# Altium schematic sheet [1] Power.SchDoc: Power
size A4; ApprovedBy: Muhammet YILDIZ; CheckedBy: Muhammet YILDIZ; Author: Muhammet YILDIZ; CompanyName: YıLDıZ IoT; DrawnBy: Muhammet YILDIZ; Engineer: Muhammet YILDIZ; Organization: YıLDıZ IoT; Address1: Elperek Mahallesi; Address2: Saray Sokak No:12; Address3: SAKARYA / TURKEY; Revision: 1; SheetNumber: 1; SheetTotal: 7; SheetSize: A4
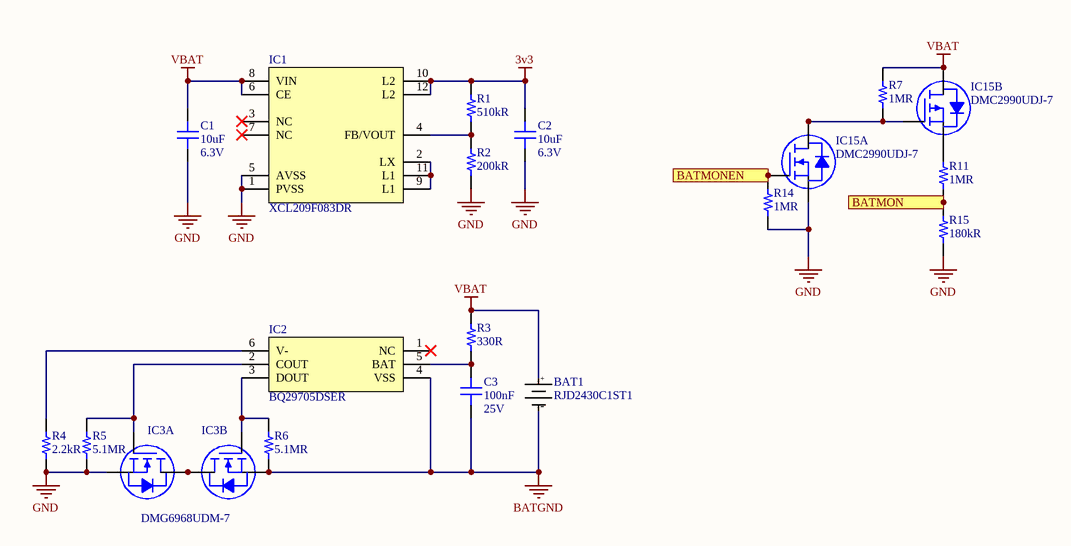
[diagram p0: [1] Power.SchDoc]

## Parts
BAT1  RJD2430C1ST1  [ILLINOIS RJD2430C1ST1]
C1  10uF  Voltage Rating: 6.3V  [CAP 0402/1005]
C2  10uF  Voltage Rating: 6.3V  [CAP 0402/1005]
C3  100nF  Voltage Rating (DC): 25V  [CAP 0402/1005]
IC1  XCL209F083DR  [TOREX XCL209F083DR]
IC2  BQ29705DSER  [TI S-PDSO-N6 150x150x80]
IC3  DMG6968UDM-7  [DIODES SOT-26-6]  (parts A,B of 2)
IC15  DMC2990UDJ-7  [DIODE SOT-563]  (parts A,B of 2)
R1  510kR  [RES 0402/1005]
R2  200kR  [RES 0402/1005]
R3  330R  [RES 0402/1005 RF]
R4  2.2kR  [RES 0402/1005 RF]
R5  5.1MR  [RES 0402/1005]
R6  5.1MR  [RES 0402/1005]
R7  1MR  [RES 0402/1005 RF]
R11  1MR  [RES 0402/1005 RF]
R14  1MR  [RES 0402/1005 RF]
R15  180kR  [RES 0402/1005 RF]

## Ports
BATMON (out), BATMONEN (in)

## Nets
3v3: C2.2 IC1.10(L2) IC1.12(L2) R1.2
BATGND: BAT1.2(-) C3.1 IC2.4(VSS) IC3.3(S2) R6.1
GND: C1.1 C2.1 IC1.1(PVSS) IC1.5(AVSS) IC3.1(S1) IC15.1(S1) R2.1 R4.1 R5.1 R14.1 R15.1
VBAT: BAT1.1(+) C1.2 IC1.6(CE) IC1.8(VIN) IC15.5(D2) IC15.6(D2) R3.2 R7.2
BATMON: R11.1 R15.2 ; port BATMON
BATMONEN: IC15.6(G1) R14.2 ; port BATMONEN
NetC3_2: C3.2 IC2.5(BAT) R3.1
NetIC1_2: IC1.2(LX) IC1.9(L1) IC1.11(L1)
NetIC1_4: IC1.4(FB/VOUT) R1.1 R2.2
NetIC2_2: IC2.2(COUT) IC3.6(G1) R5.2
NetIC2_3: IC2.3(DOUT) IC3.4(G2) R6.2
NetIC2_6: IC2.6(V-) R4.2
NetIC3_2: IC3.2(D1) IC3.5(D1)
NetIC15_2: IC15.2(D1) IC15.4(G2) IC15.5(D1) R7.1
NetIC15_3: IC15.3(S2) R11.2

Not connected (* = marked no-connect by the designer): IC1 3(NC)* 7(NC)*; IC2 1(NC)*

## Notes on the sheet
- Title:
- Size:
- Project:
- Revision:
- Sheet
- of
- Date:
- YıLDıZ IoT
- Elperek Mahallesi
- Saray Sokak, No:12
- SAKARYA / TURKEY
- File:

## Library data of the parts
BAT1 = ILLINOIS RJD2430C1ST1: Rechargeable Ion Lithium Coin-Cell Battery, Standard Lead Option. Capacity - Nom - 110mAh, Min - 104mAh; Manufacturer: Cornell Dubilier; Supplier 1: Digi-Key; Supplier Part Number 1: 1572-1630-ND; Manufacturer Part Number: RJD2430C1ST1; RoHS: No
C1 C2 = Capacitor - Ceramic: 0402 10 uF 6.3 V ±20 % Tolerance X5R Surface Mount Multilayer Ceramic Capacitor; Manufacturer: Murata; Manufacturer Part Number: GRM155R60J106ME15D; Tolerance: 20%; Supplier 1: Digi-Key; Supplier Part Number 1: 490-13238-1-ND; RoHS: Yes; Category: Ceramic Capacitors; Pricing 1: 1=0,18000, 10=0,12400, 50=0,07440, 100=0,06280, 500=0,04296, 1000=0,03800, 2500=0,03635, 5000=0,03304 (USD); Mount: Surface Mount; Case/Package: 0402; Case Code (Metric): 1005; Case Code (Imperial): 0402; Min Operating Temperature: -55°C; Max Operating Temperature: 85°C; Packaging: Tape and Reel; Capacitance: 10uF; Voltage Rating (DC): 6.3V; Dielectric: X5R; Length: 0.039inch; Width: 0.02inch; Thickness: 0.026inch; RoHS Compliant: Yes; ComponentLink1URL: https://www.murata.com/~/media/webrenewal/support/library/catalog/products/capacitor/mlcc/c02e.ashx?la=en-us&src-supplier=Digi-Key; ComponentLink1Description: https://www.murata.com/~/media/webrenewal/support/library/catalog/products/capacitor/mlcc/c02e.ashx?la=en-us&src-supplier=Digi-Key
C3 = Capacitor - Ceramic: Cap Ceramic 0.1uF 25V X5R 10% Pad SMD 0402 85¡ãC T/R / Multi Layer Ceramic Capacitor (MLCC); Manufacturer: Samsung; Manufacturer Part Number: CL05A104KA5NNNC; Supplier 1: Digi-Key; Supplier Part Number 1: 1276-1043-6-ND; RoHS: Yes; Category: Ceramic Capacitors; Pricing 1: 1=0,10000, 10=0,01100, 50=0,00600, 100=0,00490, 500=0,00346, 1000=0,00272, 2500=0,00248, 5000=0,00228 (USD); Mount: Surface Mount; Case/Package: 0402; Case Code (Imperial): 0402; Case Code (Metric): 1005; Min Operating Temperature: -55°C; Max Operating Temperature: 85°C; Capacitance: 100nF; Packaging: Tape and Reel; Tolerance: 10%; Package Quantity: 1; Voltage Rating: 25V; Dielectric: X5R; Voltage: 25V; Length: 1mm; Width: 0.02inch; Height: 0.5mm; Thickness: 0.022inch; Depth: 0.5mm; Radiation Hardening: No; Lead Free: Lead Free; ComponentLink1URL: https://datasheet.ciiva.com/25802/cl05a104ka5nnnc-25802704.pdf?src-supplier=Digi-Key; ComponentLink1Description: https://datasheet.ciiva.com/25802/cl05a104ka5nnnc-25802704.pdf?src-supplier=Digi-Key; ComponentLink2URL: https://datasheet.ciiva.com/16437/cl05a104ka5nnnc-16437369.pdf?src-supplier=Future+Electronics; ComponentLink2Description: https://datasheet.ciiva.com/16437/cl05a104ka5nnnc-16437369.pdf?src-supplier=Future+Electronics; ComponentLink3URL: https://datasheet.ciiva.com/26838/getdatasheetpartid-357412-26838142.pdf?src-supplier=Verical; ComponentLink3Description: https://datasheet.ciiva.com/26838/getdatasheetpartid-357412-26838142.pdf?src-supplier=Verical; ComponentLink4URL: https://datasheet.ciiva.com/26309/mlcc-catalogdownload2013-eng-26309014.pdf?src-supplier=Distrelec; ComponentLink4Description: https://datasheet.ciiva.com/26309/mlcc-catalogdownload2013-eng-26309014.pdf?src-supplier=Distrelec
IC1 = TOREX XCL209F083DR: Conv DC-DC 1.8V to 6V Step Down Single-Out 0.9V to 6V 0.4A 8-Pin USP-10B03; Manufacturer: Torex; Switching Frequency: 3.45MHz; Number of Outputs: 1; Output Voltage: 800mV; Output Current: 400mA; Efficiency: 90%; Output Type: Adjustable; Supplier 1: Digi-Key; Supplier Part Number 1: 893-1172-1-ND; Manufacturer Part Number: XCL209F083DR; RoHS: Yes; Category: Board Mount Modules; Stock 1: 9897; Pricing 1: 1=1,45000, 5=1,42800, 10=1,40800, 25=1,36640, 50=1,32520, 100=1,28370, 250=1,24232, 500=1,15948 (USD); Mount: Surface Mount; Case/Package: 2520; Number of Pins: 10; Case Code (Metric): 5650; Case Code (Imperial): 2520; Min Operating Temperature: -40°C; Max Operating Temperature: 85°C; Package Quantity: 1; Packaging: Cut Tape; Min Input Voltage: 1.8V; Max Input Voltage: 6V; Voltage - Output 1: 6V; Max Output Current: 400mA; Nominal Output Voltage: 800mV; Features: UVLO,SCP; Series: XCL209; Length: 0.1inch; Width: 0.08inch; Height: 0.04inch; REACH SVHC: No SVHC; RoHS Compliant: Yes; ComponentLink1URL: https://datasheet.ciiva.com/6783/1644175-6783217.pdf?src-supplier=Newark; ComponentLink1Description: https://datasheet.ciiva.com/6783/1644175-6783217.pdf?src-supplier=Newark; ComponentLink2URL: https://datasheet.ciiva.com/7658/1644175-7658934.pdf?src-supplier=Element14; ComponentLink2Description: https://datasheet.ciiva.com/7658/1644175-7658934.pdf?src-supplier=Element14; ComponentLink3URL: https://datasheet.ciiva.com/14152/xcl208-209-eng-tds-14152429.pdf?src-supplier=Distrelec; ComponentLink3Description: https://datasheet.ciiva.com/14152/xcl208-209-eng-tds-14152429.pdf?src-supplier=Distrelec
IC2 = TI BQ29705: Li-Ion/Li Polymer Advanced Single-Cell Battery Protector IC Family 6-WSON -40 to 85; Manufacturer: Texas Instruments; Number of Cells: 1; Fault Protection: Over Current,Short Circuit,Over/Under Voltage; Operating Supply Voltage: 28V; Supplier 1: Digi-Key; Supplier Part Number 1: 296-39946-1-ND; Manufacturer Part Number: BQ29705DSER; RoHS: Yes; Category: Battery Management; Stock 1: 2298; Pricing 1: 1=0,59000, 10=0,52100, 25=0,48960, 100=0,39970, 250=0,37128, 500=0,31600, 1000=0,27650 (USD); Mount: Surface Mount; Case/Package: WFDFN; Number of Pins: 6; Contact Plating: Gold; Min Operating Temperature: -40°C; Max Operating Temperature: 85°C; Packaging: Tape and Reel; Lead Free: Lead Free; RoHS Compliant: Yes; ComponentLink1URL: http://www.ti.com/lit/gpn/bq2970?src-supplier=Mouser; ComponentLink1Description: http://www.ti.com/lit/gpn/bq2970?src-supplier=Mouser; ComponentLink2URL: http://www.ti.com/lit/pdf/sluuaz3?src-supplier=Digi-Key; ComponentLink2Description: http://www.ti.com/lit/pdf/sluuaz3?src-supplier=Digi-Key; ComponentLink3URL: http://www.ti.com/lit/ds/symlink/bq2971.pdf?src-supplier=Digi-Key; ComponentLink3Description: http://www.ti.com/lit/ds/symlink/bq2971.pdf?src-supplier=Digi-Key; ComponentLink4URL: http://www.ti.com/general/docs/lit/getliterature.tsp?genericPartNumber=BQ2970&&fileType=pdf&src-supplier=Avnet; ComponentLink4Description: http://www.ti.com/general/docs/lit/getliterature.tsp?genericPartNumber=BQ2970&&fileType=pdf&src-supplier=Avnet
IC3 = DIODES DMG6968: Transistor MOSFET Array Dual N-CH 20V 6.5A 6-Pin SOT-26 T/R; Manufacturer: Diodes; Rds On Max: 24mR; Input Capacitance: 143pF; Max Power Dissipation: 850mW; Number of Elements: 2; Rise Time: 78ns; Turn-Off Delay Time: 562ns; Turn-On Delay Time: 53ns; Fall Time: 234ns; Gate to Source Voltage (Vgs): 8V; FET Type: 2 N-Channel; Polarity: N-CHANNEL; Supplier 1: Digi-Key; Supplier Part Number 1: DMG6968UDMDICT-ND; Manufacturer Part Number: DMG6968UDM-7; RoHS: Yes; Category: MOSFETs; Stock 1: 7421; Pricing 1: 1=0,51000, 10=0,43300, 100=0,32340, 500=0,25410, 1000=0,19635 (USD); Mount: Surface Mount; Case/Package: SOT-26; Number of Pins: 6; Min Operating Temperature: -55°C; Max Operating Temperature: 150°C; Package Quantity: 3000; Packaging: Tape and Reel; Drain to Source Voltage (Vdss): 20V; Continuous Drain Current (ID): 6.5A; Drain to Source Breakdown Voltage: 20V; Drain to Source Resistance: 24mR; Power Dissipation: 850mW; Element Configuration: Dual; Number of Channels: 2; On-State Resistance: 24mR; Series: -; Drain-source On Resistance-Max: 24mR; Length: 3mm; Width: 1.6mm; Height: 1.1mm; Radiation Hardening: No; REACH SVHC: No SVHC; Lead Free: Lead Free; RoHS Compliant: Yes; ComponentLink1URL: https://datasheet.ciiva.com/929/ds31758-929568.pdf?src-supplier=Digi-Key; ComponentLink1Description: https://datasheet.ciiva.com/929/ds31758-929568.pdf?src-supplier=Digi-Key; ComponentLink2URL: https://datasheet.ciiva.com/11174/ds31758-11174898.pdf?src-supplier=Avnet; ComponentLink2Description: https://datasheet.ciiva.com/11174/ds31758-11174898.pdf?src-supplier=Avnet; ComponentLink3URL: https://datasheet.ciiva.com/4443/ds31758-90272-4443012.pdf?src-supplier=Mouser; ComponentLink3Description: https://datasheet.ciiva.com/4443/ds31758-90272-4443012.pdf?src-supplier=Mouser; ComponentLink4URL: https://datasheet.ciiva.com/929/ds31758-929569.pdf?src-supplier=Digi-Key; ComponentLink4Description: https://datasheet.ciiva.com/929/ds31758-929569.pdf?src-supplier=Digi-Key
IC15 = DIODES DMC2400: Trans MOSFET N/P-CH 20V 0.45A/0.31A Automotive 6-Pin SOT-963 T/R; Manufacturer: Diodes; Rds On Max: 990mR; Input Capacitance: 27.6pF; Rise Time: 5.7ns; Continuous Drain Current (ID): 310mA; Max Power Dissipation: 350mW; Number of Channels: 2; Drain to Source Resistance: 1.9R; Gate to Source Voltage (Vgs): 8V; Fall Time: 16.4ns; Turn-Off Delay Time: 31.1ns; Turn-On Delay Time: 5.8ns; FET Type: N and P-Channel; Polarity: N-CHANNEL,P-CHANNEL; Supplier 1: Digi-Key; Supplier Part Number 1: DMC2990UDJ-7DICT-ND; Manufacturer Part Number: DMC2990UDJ-7; RoHS: Yes; Category: MOSFETs; Stock 1: 297152; Pricing 1: 1=0.45000, 10=0.36700, 100=0.24960, 500=0.18718, 1000=0.14038, 2000=0.12869, 5000=0.12088 (USD); Mount: Surface Mount; Case/Package: SOT-963; Number of Pins: 6; Min Operating Temperature: -55°C; Max Operating Temperature: 150°C; Packaging: Tape and Reel; Package Quantity: 10000; Drain to Source Voltage (Vdss): 20V; Drain to Source Breakdown Voltage: 20V; Series: -; Length: 1.05mm; Width: 0.85mm; Height: 0.45mm; Radiation Hardening: No; Lead Free: Lead Free; REACH SVHC: No SVHC; RoHS Compliant: Yes; ComponentLink1URL: https://datasheet.ciiva.com/11174/dmc2990udj-11174946.pdf?src-supplier=Avnet; ComponentLink1Description: https://datasheet.ciiva.com/11174/dmc2990udj-11174946.pdf?src-supplier=Avnet; ComponentLink2URL: https://datasheet.ciiva.com/13045/dmc2990udj-73233-13045836.pdf?src-supplier=Mouser; ComponentLink2Description: https://datasheet.ciiva.com/13045/dmc2990udj-73233-13045836.pdf?src-supplier=Mouser; ComponentLink3URL: https://datasheet.ciiva.com/928/dmc2990udj-928614.pdf?src-supplier=Digi-Key; ComponentLink3Description: https://datasheet.ciiva.com/928/dmc2990udj-928614.pdf?src-supplier=Digi-Key; ComponentLink4URL: https://datasheet.ciiva.com/928/dmc2990udj-928615.pdf?src-supplier=Digi-Key; ComponentLink4Description: https://datasheet.ciiva.com/928/dmc2990udj-928615.pdf?src-supplier=Digi-Key; ComponentLink5URL: https://datasheet.ciiva.com/928/dmc2990udj-928616.pdf?src-supplier=Digi-Key; ComponentLink5Description: https://datasheet.ciiva.com/928/dmc2990udj-928616.pdf?src-supplier=Digi-Key; ComponentLink6URL: https://datasheet.ciiva.com/17323/dmc2990udj-17323996.pdf?src-supplier=Avnet+Europe; ComponentLink6Description: https://datasheet.ciiva.com/17323/dmc2990udj-17323996.pdf?src-supplier=Avnet+Europe
R1 = Resistor_Chip: Surface Mount Chip Resistor, Thick Film, RC Series, 510 kohm, 63 mW, 1%, 50 V, 0402 [1005 Metric]; Manufacturer: Yageo; Manufacturer Part Number: RC0402FR-07510KL; Voltage Rating (DC): 50V; Power Rating: 63mW; Temperature Coefficient: 100ppm/°C; Supplier 1: Digi-Key; Supplier Part Number 1: 311-510KLRCT-ND; RoHS: Yes; Category: Chip SMD Resistors; Stock 1: 569113; Pricing 1: 1=0,10000, 10=0,01600, 100=0,00660, 1000=0,00299, 2500=0,00259, 5000=0,00214 (USD); Case/Package: 0402; Case Code (Imperial): 0402; Case Code (Metric): 1005; Size Code: 0402; Min Operating Temperature: -55°C; Max Operating Temperature: 155°C; Tolerance: 1%; Resistance: 510kR; Packaging: Tape and Reel; Package Quantity: 1; Features: Moisture Resistant; Voltage Rating: 50V; Termination: SMD/SMT; Resistor Type: Thick Film; Number of Terminations: 2; Max Power Dissipation: 63mW; Series: RC; Construction: Rectangular; Resistance Tolerance: 1%; Technology: THICK FILM; Length: 1mm; Width: 0.5mm; Height: 0.016inch; Depth: 0.5mm; Lead Free: Lead Free; REACH SVHC: Unknown; Military Standard: Not; RoHS Compliant: Yes; ComponentLink1URL: https://datasheet.ciiva.com/11808/0900766b80c66297-11808810.pdf?src-supplier=RSComponents; ComponentLink1Description: https://datasheet.ciiva.com/11808/0900766b80c66297-11808810.pdf?src-supplier=RSComponents; ComponentLink2URL: https://datasheet.ciiva.com/2453/pyu-r-int-thick-7-2453463.pdf?src-supplier=Digi-Key; ComponentLink2Description: https://datasheet.ciiva.com/2453/pyu-r-int-thick-7-2453463.pdf?src-supplier=Digi-Key; ComponentLink3URL: https://datasheet.ciiva.com/2453/pyu-r-int-thick-7-2453464.pdf?src-supplier=Digi-Key; ComponentLink3Description: https://datasheet.ciiva.com/2453/pyu-r-int-thick-7-2453464.pdf?src-supplier=Digi-Key; ComponentLink4URL: https://datasheet.ciiva.com/2453/pyu-r-int-thick-7-2453465.pdf?src-supplier=Digi-Key; ComponentLink4Description: https://datasheet.ciiva.com/2453/pyu-r-int-thick-7-2453465.pdf?src-supplier=Digi-Key; ComponentLink5URL: https://datasheet.ciiva.com/17419/pyu-rc0402-51-rohs-l-6-r-17419596.pdf?src-supplier=Future+Electronics; ComponentLink5Description: https://datasheet.ciiva.com/17419/pyu-rc0402-51-rohs-l-6-r-17419596.pdf?src-supplier=Future+Electronics
R2 = Resistor_Chip: Res General Purpose Thick Film 0402 200K Ohm 1% 1/16W ±100ppm/°C Molded SMD Paper T/R; Manufacturer: Yageo; Manufacturer Part Number: RC0402FR-07200KL; Power Rating: 62.5mW; Voltage Rating: 50V; Max Power Dissipation: 63mW; Supplier 1: Digi-Key; Supplier Part Number 1: 311-200KLRCT-ND; RoHS: Yes; Category: Chip SMD Resistors; Stock 1: 4634442; Pricing 1: 1=0,10000, 10=0,01600, 100=0,00660, 1000=0,00299, 2500=0,00259, 5000=0,00214 (USD); Case/Package: 0402; Case Code (Metric): 1005; Case Code (Imperial): 0402; Min Operating Temperature: -55°C; Max Operating Temperature: 155°C; Resistance: 200kR; Tolerance: 1%; Package Quantity: 1; Packaging: Tape and Reel; Resistor Type: Thick Film; Number of Terminations: 2; Termination: SMD/SMT; Temperature Coefficient: 100ppm/°C; Voltage Rating (DC): 50V; Features: Moisture Resistant; Series: RC; Construction: Rectangular; Resistance Tolerance: 1%; Technology: THICK FILM; Working Voltage: 50V; Length: 1mm; Width: 0.02inch; Height: 0.016inch; Depth: 0.5mm; REACH SVHC: No SVHC; Military Standard: Not; Lead Free: Lead Free; RoHS Compliant: Yes; ComponentLink1URL: https://datasheet.ciiva.com/2453/pyu-r-int-thick-7-2453556.pdf?src-supplier=Digi-Key; ComponentLink1Description: https://datasheet.ciiva.com/2453/pyu-r-int-thick-7-2453556.pdf?src-supplier=Digi-Key; ComponentLink2URL: https://datasheet.ciiva.com/2453/pyu-r-int-thick-7-2453557.pdf?src-supplier=Digi-Key; ComponentLink2Description: https://datasheet.ciiva.com/2453/pyu-r-int-thick-7-2453557.pdf?src-supplier=Digi-Key; ComponentLink3URL: https://datasheet.ciiva.com/15189/getdatasheetpartid-323720-15189381.pdf?src-supplier=Verical; ComponentLink3Description: https://datasheet.ciiva.com/15189/getdatasheetpartid-323720-15189381.pdf?src-supplier=Verical; ComponentLink4URL: https://datasheet.ciiva.com/2453/pyu-r-int-thick-7-2453558.pdf?src-supplier=Digi-Key; ComponentLink4Description: https://datasheet.ciiva.com/2453/pyu-r-int-thick-7-2453558.pdf?src-supplier=Digi-Key; ComponentLink5URL: https://datasheet.ciiva.com/12667/pyu-rc0402-51-rohs-l-6-r-12667911.pdf?src-supplier=Mouser; ComponentLink5Description: https://datasheet.ciiva.com/12667/pyu-rc0402-51-rohs-l-6-r-12667911.pdf?src-supplier=Mouser; ComponentLink6URL: https://datasheet.ciiva.com/7849/1018594-7849896.pdf?src-supplier=Element14; ComponentLink6Description: https://datasheet.ciiva.com/7849/1018594-7849896.pdf?src-supplier=Element14; ComponentLink7URL: https://datasheet.ciiva.com/7849/1018594-7849897.pdf?src-supplier=Element14; ComponentLink7Description: https://datasheet.ciiva.com/7849/1018594-7849897.pdf?src-supplier=Element14; ComponentLink8URL: https://datasheet.ciiva.com/46394/1018594-46394953.pdf?src-supplier=Element14; ComponentLink8Description: https://datasheet.ciiva.com/46394/1018594-46394953.pdf?src-supplier=Element14; ComponentLink9URL: https://datasheet.ciiva.com/16740/pyu-rc0402-51-rohs-l-6-r-16740636.pdf?src-supplier=Future+Electronics; ComponentLink9Description: https://datasheet.ciiva.com/16740/pyu-rc0402-51-rohs-l-6-r-16740636.pdf?src-supplier=Future+Electronics
R3 = Resistor_Chip: Res Thick Film 0402 330 Ohm 1% 0.063W(1/16W) ±100ppm/C Pad SMD T/R; Manufacturer: Walsin Technologies; Manufacturer Part Number: WR04X3300FTL; Voltage Rating: 50V; Power Rating: 62.5mW; Temperature Coefficient: 100ppm/°C; Supplier 1: Digi-Key; Supplier Part Number 1: 1292-WR04X3300FTLCT-ND; RoHS: Yes; Category: Chip SMD Resistors; Stock 1: 4930; Pricing 1: 1=0,10000, 10=0,01000, 100=0,00360, 1000=0,00162, 2500=0,00140, 5000=0,00116 (USD); Case/Package: Molded; Case Code (Metric): 1005; Case Code (Imperial): 0402; Contact Material: Tin; Min Operating Temperature: -55°C; Max Operating Temperature: 155°C; Packaging: Tape and Reel; Resistance: 330R; Tolerance: 1%; Resistor Type: Thick Film,Metal Oxide; Voltage Rating (DC): 50V; Length: 1mm; Depth: 0.5mm; REACH SVHC: Unknown; Military Standard: Not; Lead Free: Lead Free; RoHS Compliant: Yes; ComponentLink1URL: http://www.farnell.com/datasheets/1960319.pdf?src-supplier=Farnell; ComponentLink1Description: http://www.farnell.com/datasheets/1960319.pdf?src-supplier=Farnell; ComponentLink2URL: https://www.verical.com/server-webapp/html/getDatasheet?partID=413958&src-supplier=Verical; ComponentLink2Description: https://www.verical.com/server-webapp/html/getDatasheet?partID=413958&src-supplier=Verical; ComponentLink3URL: http://components.arrow.com/part/dataview/0323_00666659?src-supplier=Arrow+Europe; ComponentLink3Description: http://components.arrow.com/part/dataview/0323_00666659?src-supplier=Arrow+Europe; ComponentLink4URL: http://www.farnell.com/datasheets/1960319.pdf?src-supplier=Element14; ComponentLink4Description: http://www.farnell.com/datasheets/1960319.pdf?src-supplier=Element14
R4 = Resistor_Chip: Res General Purpose Thick Film 0402 2.2k Ohm 1% 1/16W ±100ppm/°C Molded Paper T/R; Manufacturer: TE Connectivity; Manufacturer Part Number: CRGCQ0402F2K2; Max Power Dissipation: 63mW; Supplier 1: Digi-Key; Supplier Part Number 1: A129631CT-ND; RoHS: Yes; Category: Chip SMD Resistors; Stock 1: 176792; Pricing 1: 1=0,10000, 10=0,02600, 100=0,01040, 1000=0,00466, 2500=0,00405, 5000=0,00334 (USD); Case/Package: 0402; Case Code (Imperial): 0402; Case Code (Metric): 1005; Min Operating Temperature: -55°C; Max Operating Temperature: 155°C; Resistor Type: Thick Film; Features: Moisture Resistant,Automotive AEC-Q200; Packaging: Cut Tape; Resistance: 2.2kR; Tolerance: 1%; Temperature Coefficient: 100ppm/°C; Number of Terminations: 2; RoHS Compliant: Yes; ComponentLink1URL: http://www.te.com/commerce/DocumentDelivery/DDEController?Action=srchrtrv&DocNm=1773204-3&DocType=DS&DocLang=English&src-supplier=Digi-Key; ComponentLink1Description: http://www.te.com/commerce/DocumentDelivery/DDEController?Action=srchrtrv&DocNm=1773204-3&DocType=DS&DocLang=English&src-supplier=Digi-Key; ComponentLink2URL: https://4donline.ihs.com/images/VipMasterIC/IC/TYEL/TYEL-S-A0004929575/TYEL-S-A0004929575-1.pdf?hkey=52A5661711E402568146F3353EA87419&src-supplier=Newark; ComponentLink2Description: https://4donline.ihs.com/images/VipMasterIC/IC/TYEL/TYEL-S-A0004929575/TYEL-S-A0004929575-1.pdf?hkey=52A5661711E402568146F3353EA87419&src-supplier=Newark; ComponentLink3URL: https://www.te.com/commerce/DocumentDelivery/DDEController?Action=srchrtrv&DocNm=1773204-3&DocType=DS&DocLang=English&src-supplier=Digi-Key; ComponentLink3Description: https://www.te.com/commerce/DocumentDelivery/DDEController?Action=srchrtrv&DocNm=1773204-3&DocType=DS&DocLang=English&src-supplier=Digi-Key; ComponentLink4URL: https://4donline.ihs.com/images/VipMasterIC/IC/TYEL/TYEL-S-A0004929575/TYEL-S-A0004929575-1.pdf?hkey=52A5661711E402568146F3353EA87419&src-supplier=Farnell; ComponentLink4Description: https://4donline.ihs.com/images/VipMasterIC/IC/TYEL/TYEL-S-A0004929575/TYEL-S-A0004929575-1.pdf?hkey=52A5661711E402568146F3353EA87419&src-supplier=Farnell; ComponentLink5URL: https://www.te.com/commerce/DocumentDelivery/DDEController?Action=srchrtrv&amp;DocNm=1773204-3&amp;DocType=DS&amp;DocLang=English&src-supplier=Digi-Key; ComponentLink5Description: https://www.te.com/commerce/DocumentDelivery/DDEController?Action=srchrtrv&amp;DocNm=1773204-3&amp;DocType=DS&amp;DocLang=English&src-supplier=Digi-Key
R5 R6 = Resistor_Chip: Res Thick Film 0402 5.1M Ohm 1% 0.063W ±200ppm/°C Molded SMD Paper T/R; Manufacturer: Stackpole Electronics; Manufacturer Part Number: RMCF0402FT5M10; Max Power Dissipation: 63mW; Supplier 1: Digi-Key; Supplier Part Number 1: RMCF0402FT5M10CT-ND; RoHS: Yes; Category: Chip SMD Resistors; Stock 1: 115841; Pricing 1: 1=0,10000, 10=0,02000, 100=0,00810, 1000=0,00366, 2500=0,00318, 5000=0,00262 (USD); Mount: Surface Mount; Case/Package: 0402; Contact Plating: Tin,Matte; Min Operating Temperature: -55°C; Max Operating Temperature: 155°C; Packaging: Tape and Reel; Resistance: 5.1MR; Tolerance: 1%; Resistor Type: Thick Film; Number of Terminations: 2; Temperature Coefficient: 200ppm/°C; Features: Automotive AEC-Q200; Series: RMCF; Length: 0.039inch; Width: 0.02inch; Height: 0.016inch; Radiation Hardening: No; RoHS Compliant: Yes; ComponentLink1URL: https://www.seielect.com/Catalog/SEI-RMCF_RMCP.pdf?src-supplier=Digi-Key; ComponentLink1Description: https://www.seielect.com/Catalog/SEI-RMCF_RMCP.pdf?src-supplier=Digi-Key; ComponentLink2URL: https://www.seielect.com/catalog/SEI-RMCF_RMCP.pdf?src-supplier=Avnet; ComponentLink2Description: https://www.seielect.com/catalog/SEI-RMCF_RMCP.pdf?src-supplier=Avnet; ComponentLink3URL: https://www.seielect.com/catalog/SEI-Packaging.pdf?src-supplier=Digi-Key; ComponentLink3Description: https://www.seielect.com/catalog/SEI-Packaging.pdf?src-supplier=Digi-Key
R7 R11 R14 = Resistor_Chip: Res Thick Film 0402 1M Ohm 1% 0.063W(1/16W) ±100ppm/C Pad SMD Automotive T/R; Manufacturer: TE Connectivity; Manufacturer Part Number: CRGCQ0402F1M0; Max Power Dissipation: 63mW; Temperature Coefficient: 100ppm/°C; Supplier 1: Digi-Key; Supplier Part Number 1: A129663CT-ND; RoHS: Yes; Category: Chip SMD Resistors; Stock 1: 5520437; Pricing 1: 1=0.10000, 10=0.02600, 100=0.01040, 1000=0.00466, 2500=0.00405, 5000=0.00334 (USD); Case/Package: 0402; Case Code (Imperial): 0402; Case Code (Metric): 1005; Min Operating Temperature: -55°C; Max Operating Temperature: 155°C; Resistor Type: Thick Film; Features: Moisture Resistant,Automotive AEC-Q200; Packaging: Tape and Reel; Resistance: 1MR; Tolerance: 1%; Number of Terminations: 2; RoHS Compliant: Yes; ComponentLink1URL: https://4donline.ihs.com/images/VipMasterIC/IC/TYEL/TYEL-S-A0004929575/TYEL-S-A0004929575-1.pdf?hkey=52A5661711E402568146F3353EA87419&src-supplier=Farnell; ComponentLink1Description: https://4donline.ihs.com/images/VipMasterIC/IC/TYEL/TYEL-S-A0004929575/TYEL-S-A0004929575-1.pdf?hkey=52A5661711E402568146F3353EA87419&src-supplier=Farnell; ComponentLink2URL: https://4donline.ihs.com/images/VipMasterIC/IC/TYEL/TYEL-S-A0004929575/TYEL-S-A0004929575-1.pdf?hkey=52A5661711E402568146F3353EA87419&src-supplier=Newark; ComponentLink2Description: https://4donline.ihs.com/images/VipMasterIC/IC/TYEL/TYEL-S-A0004929575/TYEL-S-A0004929575-1.pdf?hkey=52A5661711E402568146F3353EA87419&src-supplier=Newark; ComponentLink3URL: https://www.te.com/commerce/DocumentDelivery/DDEController?Action=srchrtrv&amp;DocNm=1773204-3&amp;DocType=DS&amp;DocLang=English&src-supplier=Digi-Key; ComponentLink3Description: https://www.te.com/commerce/DocumentDelivery/DDEController?Action=srchrtrv&amp;DocNm=1773204-3&amp;DocType=DS&amp;DocLang=English&src-supplier=Digi-Key; ComponentLink4URL: https://4donline.ihs.com/images/VipMasterIC/IC/TYEL/TYEL-S-A0004929575/TYEL-S-A0004929575-1.pdf?hkey=52A5661711E402568146F3353EA87419&src-supplier=Element14; ComponentLink4Description: https://4donline.ihs.com/images/VipMasterIC/IC/TYEL/TYEL-S-A0004929575/TYEL-S-A0004929575-1.pdf?hkey=52A5661711E402568146F3353EA87419&src-supplier=Element14; ComponentLink5URL: https://www.te.com/commerce/DocumentDelivery/DDEController?Action=srchrtrv&DocNm=1773204-3&DocType=DS&DocLang=English&src-supplier=Digi-Key; ComponentLink5Description: https://www.te.com/commerce/DocumentDelivery/DDEController?Action=srchrtrv&DocNm=1773204-3&DocType=DS&DocLang=English&src-supplier=Digi-Key
R15 = Resistor_Chip: Res General Purpose Thick Film 0402 180k Ohm 1% 1/16W ±100ppm/°C Molded Paper T/R; Manufacturer: TE Connectivity; Manufacturer Part Number: CRGCQ0402F180K; Max Power Dissipation: 63mW; Supplier 1: Digi-Key; Supplier Part Number 1: A129654CT-ND; RoHS: Yes; Category: Chip SMD Resistors; Stock 1: 268342; Pricing 1: 1=0.10000, 10=0.02600, 100=0.01040, 1000=0.00466, 2500=0.00405, 5000=0.00334 (USD); Case/Package: 0402; Case Code (Imperial): 0402; Case Code (Metric): 1005; Min Operating Temperature: -55°C; Max Operating Temperature: 155°C; Resistor Type: Thick Film; Features: Moisture Resistant,Automotive AEC-Q200; Packaging: Tape and Reel; Resistance: 180kR; Tolerance: 1%; Temperature Coefficient: 100ppm/°C; Number of Terminations: 2; RoHS Compliant: Yes; ComponentLink1URL: https://www.te.com/commerce/DocumentDelivery/DDEController?Action=srchrtrv&amp;DocNm=1773204-3&amp;DocType=DS&amp;DocLang=English&src-supplier=Digi-Key; ComponentLink1Description: https://www.te.com/commerce/DocumentDelivery/DDEController?Action=srchrtrv&amp;DocNm=1773204-3&amp;DocType=DS&amp;DocLang=English&src-supplier=Digi-Key; ComponentLink2URL: https://www.te.com/commerce/DocumentDelivery/DDEController?Action=srchrtrv&DocNm=1773204-3&DocType=DS&DocLang=English&src-supplier=Digi-Key; ComponentLink2Description: https://www.te.com/commerce/DocumentDelivery/DDEController?Action=srchrtrv&DocNm=1773204-3&DocType=DS&DocLang=English&src-supplier=Digi-Key; ComponentLink3URL: https://4donline.ihs.com/images/VipMasterIC/IC/TYEL/TYEL-S-A0004929575/TYEL-S-A0004929575-1.pdf?hkey=52A5661711E402568146F3353EA87419&src-supplier=Newark; ComponentLink3Description: https://4donline.ihs.com/images/VipMasterIC/IC/TYEL/TYEL-S-A0004929575/TYEL-S-A0004929575-1.pdf?hkey=52A5661711E402568146F3353EA87419&src-supplier=Newark; ComponentLink4URL: https://4donline.ihs.com/images/VipMasterIC/IC/TYEL/TYEL-S-A0004929575/TYEL-S-A0004929575-1.pdf?hkey=52A5661711E402568146F3353EA87419&src-supplier=Farnell; ComponentLink4Description: https://4donline.ihs.com/images/VipMasterIC/IC/TYEL/TYEL-S-A0004929575/TYEL-S-A0004929575-1.pdf?hkey=52A5661711E402568146F3353EA87419&src-supplier=Farnell